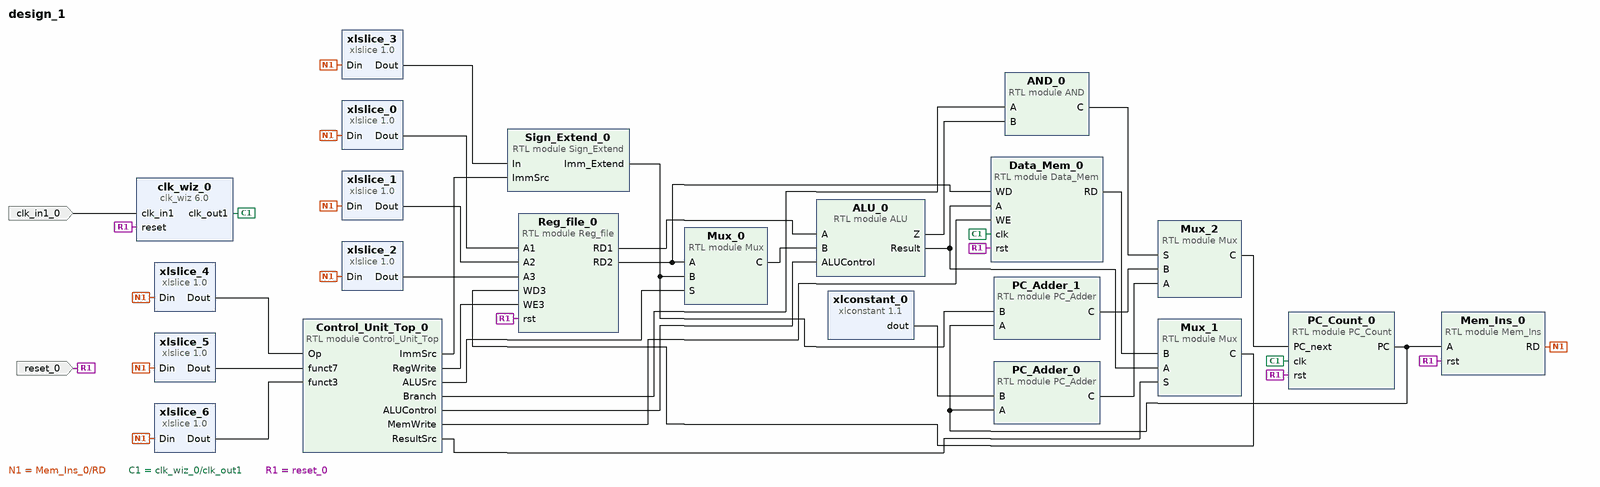
[diagram p0: block diagram of the top level]
# Vivado block design design_1, xc7k70tfbv676-1, Vivado 2024.1
create_bd_design design_1

create_bd_port -dir I -type clk clk_in1_0
set_property -dict {CONFIG.FREQ_HZ 12000000} [get_bd_ports clk_in1_0]
create_bd_port -dir I -type rst reset_0
set_property -dict {CONFIG.POLARITY ACTIVE_HIGH} [get_bd_ports reset_0]

create_bd_cell -type module -reference PC_Count PC_Count_0
create_bd_cell -type module -reference PC_Adder PC_Adder_0
create_bd_cell -type ip -vlnv xilinx.com:ip:xlconstant:1.1 xlconstant_0
set_property -dict {CONFIG.CONST_VAL 4 CONFIG.CONST_WIDTH 32} [get_bd_cells xlconstant_0]
create_bd_cell -type module -reference Mem_Ins Mem_Ins_0
create_bd_cell -type module -reference Reg_file Reg_file_0
create_bd_cell -type module -reference Sign_Extend Sign_Extend_0
create_bd_cell -type ip -vlnv xilinx.com:ip:xlslice:1.0 xlslice_0
set_property -dict {CONFIG.DIN_FROM 19 CONFIG.DIN_TO 15} [get_bd_cells xlslice_0]
create_bd_cell -type ip -vlnv xilinx.com:ip:xlslice:1.0 xlslice_1
set_property -dict {CONFIG.DIN_FROM 24 CONFIG.DIN_TO 20} [get_bd_cells xlslice_1]
create_bd_cell -type ip -vlnv xilinx.com:ip:xlslice:1.0 xlslice_2
set_property -dict {CONFIG.DIN_FROM 11 CONFIG.DIN_TO 7} [get_bd_cells xlslice_2]
create_bd_cell -type ip -vlnv xilinx.com:ip:xlslice:1.0 xlslice_3
set_property -dict {CONFIG.DIN_FROM 31 CONFIG.DIN_TO 7} [get_bd_cells xlslice_3]
create_bd_cell -type module -reference Mux Mux_0
create_bd_cell -type module -reference ALU ALU_0
create_bd_cell -type module -reference Data_Mem Data_Mem_0
create_bd_cell -type module -reference Mux Mux_1
create_bd_cell -type module -reference Control_Unit_Top Control_Unit_Top_0
create_bd_cell -type module -reference PC_Adder PC_Adder_1
create_bd_cell -type module -reference Mux Mux_2
create_bd_cell -type ip -vlnv xilinx.com:ip:xlslice:1.0 xlslice_4
set_property -dict {CONFIG.DIN_FROM 6} [get_bd_cells xlslice_4]
create_bd_cell -type ip -vlnv xilinx.com:ip:xlslice:1.0 xlslice_5
set_property -dict {CONFIG.DIN_FROM 30 CONFIG.DIN_TO 24} [get_bd_cells xlslice_5]
create_bd_cell -type ip -vlnv xilinx.com:ip:xlslice:1.0 xlslice_6
set_property -dict {CONFIG.DIN_FROM 14 CONFIG.DIN_TO 12} [get_bd_cells xlslice_6]
create_bd_cell -type module -reference AND AND_0
create_bd_cell -type ip -vlnv xilinx.com:ip:clk_wiz:6.0 clk_wiz_0
set_property -dict [list \
  CONFIG.CLKIN1_JITTER_PS 833.33 \
  CONFIG.CLKOUT1_JITTER 689.810 \
  CONFIG.CLKOUT1_PHASE_ERROR 674.235 \
  CONFIG.CLKOUT1_REQUESTED_OUT_FREQ 10 \
  CONFIG.ENABLE_CLOCK_MONITOR false \
  CONFIG.MMCM_CLKFBOUT_MULT_F 63.750 \
  CONFIG.MMCM_CLKIN1_PERIOD 83.333 \
  CONFIG.MMCM_CLKIN2_PERIOD 10.0 \
  CONFIG.MMCM_CLKOUT0_DIVIDE_F 76.500 \
  CONFIG.PRIMITIVE MMCM \
  CONFIG.PRIM_IN_FREQ 12 \
  CONFIG.USE_LOCKED false \
] [get_bd_cells clk_wiz_0]

# ---- connections ----

connect_bd_net [get_bd_pins ALU_0/Result] [get_bd_pins Data_Mem_0/A] [get_bd_pins Mux_1/A]
connect_bd_net [get_bd_pins ALU_0/Z] [get_bd_pins AND_0/B]
connect_bd_net [get_bd_pins AND_0/C] [get_bd_pins Mux_2/S]
connect_bd_net [get_bd_pins Control_Unit_Top_0/ALUControl] [get_bd_pins ALU_0/ALUControl]
connect_bd_net [get_bd_pins Control_Unit_Top_0/ALUSrc] [get_bd_pins Mux_0/S]
connect_bd_net [get_bd_pins Control_Unit_Top_0/Branch] [get_bd_pins AND_0/A]
connect_bd_net [get_bd_pins Control_Unit_Top_0/ImmSrc] [get_bd_pins Sign_Extend_0/ImmSrc]
connect_bd_net [get_bd_pins Control_Unit_Top_0/MemWrite] [get_bd_pins Data_Mem_0/WE]
connect_bd_net [get_bd_pins Control_Unit_Top_0/RegWrite] [get_bd_pins Reg_file_0/WE3]
connect_bd_net [get_bd_pins Control_Unit_Top_0/ResultSrc] [get_bd_pins Mux_1/S]
connect_bd_net [get_bd_pins Data_Mem_0/RD] [get_bd_pins Mux_1/B]
connect_bd_net [get_bd_pins Mem_Ins_0/RD] \
  [get_bd_pins xlslice_0/Din] [get_bd_pins xlslice_1/Din] [get_bd_pins xlslice_2/Din] [get_bd_pins xlslice_3/Din] \
  [get_bd_pins xlslice_4/Din] [get_bd_pins xlslice_5/Din] [get_bd_pins xlslice_6/Din]
connect_bd_net [get_bd_pins Mux_0/C] [get_bd_pins ALU_0/B]
connect_bd_net [get_bd_pins Mux_1/C] [get_bd_pins Reg_file_0/WD3]
connect_bd_net [get_bd_pins Mux_2/C] [get_bd_pins PC_Count_0/PC_next]
connect_bd_net [get_bd_pins PC_Adder_0/C] [get_bd_pins Mux_2/A]
connect_bd_net [get_bd_pins PC_Adder_1/C] [get_bd_pins Mux_2/B]
connect_bd_net [get_bd_pins PC_Count_0/PC] [get_bd_pins PC_Adder_0/A] [get_bd_pins Mem_Ins_0/A] [get_bd_pins PC_Adder_1/A]
connect_bd_net [get_bd_pins Reg_file_0/RD1] [get_bd_pins ALU_0/A]
connect_bd_net [get_bd_pins Reg_file_0/RD2] [get_bd_pins Data_Mem_0/WD] [get_bd_pins Mux_0/A]
connect_bd_net [get_bd_pins Sign_Extend_0/Imm_Extend] [get_bd_pins PC_Adder_1/B] [get_bd_pins Mux_0/B]
connect_bd_net -net clk_in1_0_1 [get_bd_ports clk_in1_0] [get_bd_pins clk_wiz_0/clk_in1]
connect_bd_net [get_bd_pins clk_wiz_0/clk_out1] [get_bd_pins Data_Mem_0/clk] [get_bd_pins PC_Count_0/clk]
connect_bd_net -net reset_0_1 [get_bd_ports reset_0] \
  [get_bd_pins clk_wiz_0/reset] [get_bd_pins Data_Mem_0/rst] [get_bd_pins PC_Count_0/rst] [get_bd_pins Reg_file_0/rst] \
  [get_bd_pins Mem_Ins_0/rst]
connect_bd_net [get_bd_pins xlconstant_0/dout] [get_bd_pins PC_Adder_0/B]
connect_bd_net [get_bd_pins xlslice_0/Dout] [get_bd_pins Reg_file_0/A1]
connect_bd_net [get_bd_pins xlslice_1/Dout] [get_bd_pins Reg_file_0/A2]
connect_bd_net [get_bd_pins xlslice_2/Dout] [get_bd_pins Reg_file_0/A3]
connect_bd_net [get_bd_pins xlslice_3/Dout] [get_bd_pins Sign_Extend_0/In]
connect_bd_net [get_bd_pins xlslice_4/Dout] [get_bd_pins Control_Unit_Top_0/Op]
connect_bd_net [get_bd_pins xlslice_5/Dout] [get_bd_pins Control_Unit_Top_0/funct7]
connect_bd_net [get_bd_pins xlslice_6/Dout] [get_bd_pins Control_Unit_Top_0/funct3]

validate_bd_design
save_bd_design
